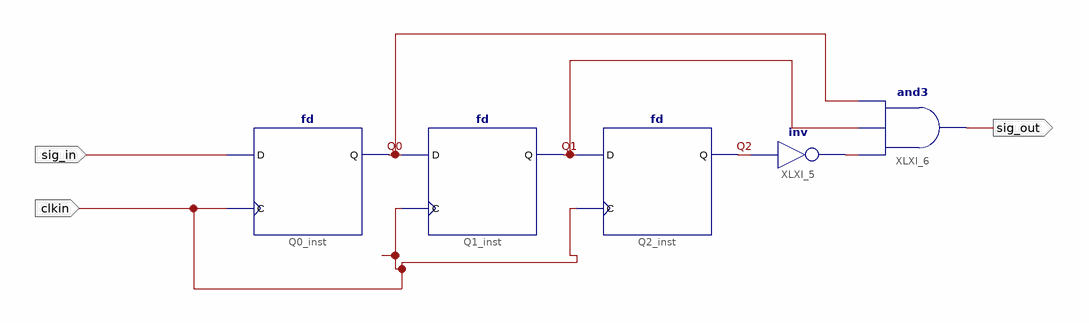
[diagram p0: schematic sheet 1]
// Xilinx ISE schematic debounce_sc.sch (spartan6) as structural Verilog: 5 symbols, 3 ports
module debounce_sc (
  input  sig_in,
  input  clkin,
  output sig_out
);

  wire Q0, Q1, Q2, XLXN_6;

  fd Q0_inst (.C(clkin), .D(sig_in), .Q(Q0));
  fd Q1_inst (.C(clkin), .D(Q0), .Q(Q1));
  fd Q2_inst (.C(clkin), .D(Q1), .Q(Q2));
  not XLXI_5 (XLXN_6, Q2);
  and XLXI_6 (sig_out, XLXN_6, Q1, Q0);
endmodule
